# EAGLE design horn (EAGLE 9.3.0)
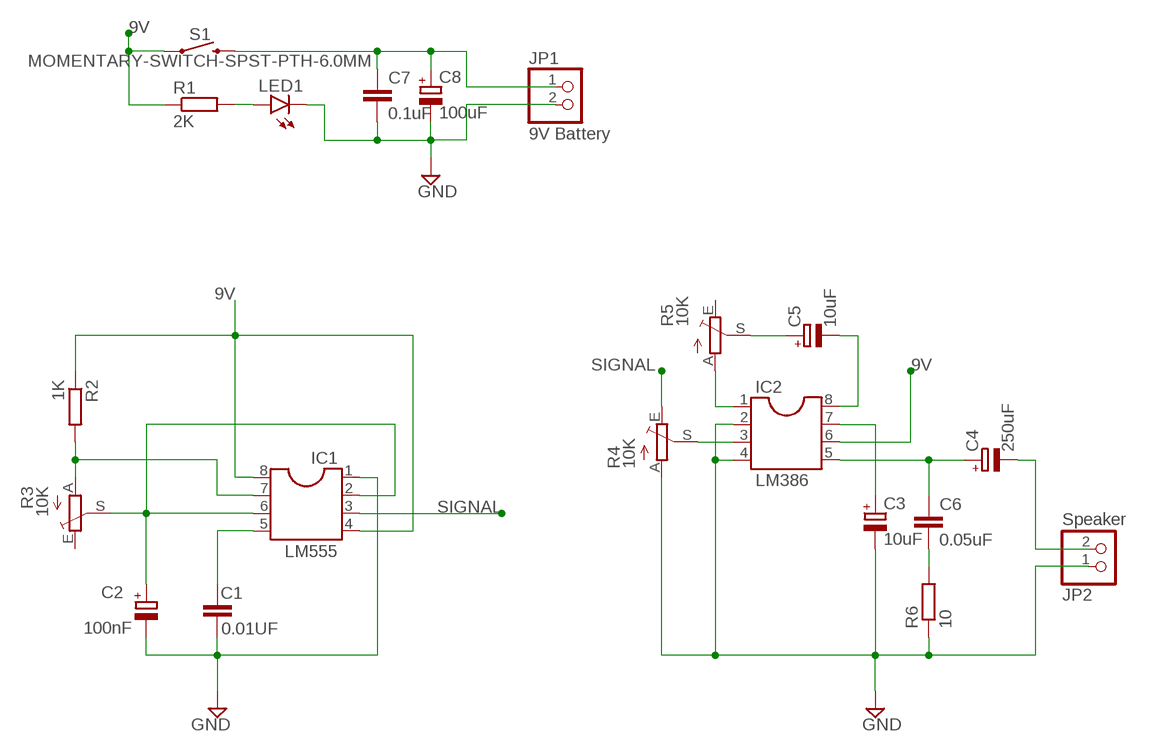
[diagram p0: schematic, sheet 1]

## Parts
C1  0.01UF  C-EU025-024X044  [C025-024X044]
C2  100nF  CPOL-EUE5-5  [E5-5]
C3  10uF  CPOL-EUE5-5  [E5-5]
C4  250uF  CPOL-EUE5-5  [E5-5]
C5  10uF  CPOL-EUE5-5  [E5-5]
C6  0.05uF  C-EU025-024X044  [C025-024X044]
C7  0.1uF  C-EU025-024X044  [C025-024X044]
C8  100uF  CPOL-EUE5-5  [E5-5]
IC1  LM555  DIL8S  [SOCKET-08]
IC2  LM386  DIL8S  [SOCKET-08]
JP1  9V Battery  PINHD-1X2  [1X02]
JP2  Speaker  PINHD-1X2  [1X02]
LED1  LED5MM  [LED5MM]
R1  2K  R-EU_0204/5  [0204/5]
R2  1K  R-EU_0204/5  [0204/5]
R3  10K  TRIM_EU-CA6V  [CA6V]
R4  10K  TRIM_EU-CA6V  [CA6V]
R5  10K  TRIM_EU-CA6V  [CA6V]
R6  10  R-EU_0204/5  [0204/5]
S1  MOMENTARY-SWITCH-SPST-PTH-6.0MM  [TACTILE_SWITCH_PTH_6.0MM]

## Nets
9V: IC1.4 IC1.8 IC2.6 R1.1 R2.1 S1.1
GND: C1.2 C2.- C3.- C7.2 C8.- IC1.1 IC2.2 IC2.4 JP1.2 JP2.1 LED1.K(C) R4.A R6.1
N$1: C7.1 C8.+ JP1.1 S1.3
N$2: C1.1 IC1.5
N$4: IC2.3 R4.S
N$5: LED1.A R1.2
N$6: IC1.7 R2.2 R3.A
N$7: C2.+ IC1.2 IC1.6 R3.S
N$9: C3.+ IC2.7
N$10: C4.+ C6.1 IC2.5
N$11: C6.2 R6.2
N$12: IC2.1 R5.A
N$13: C5.+ R5.S
N$14: C5.- IC2.8
N$15: C4.- JP2.2
SIGNAL: IC1.3 R4.E
Unconnected: R3.E R5.E

## Library data of the parts
C1 C6 C7 = resistor:C-EU: CAPACITOR, European symbol
C2-C5 C8 = resistor:CPOL-EU: POLARIZED CAPACITOR, European symbol
IC1 IC2 = ic-package:DIL8: Dual In Line / Socket
JP1 JP2 = pinhead:PINHD-1X2: PIN HEADER
LED1 = led:LED: LED OSRAM: - CHIPLED LG R971, LG N971, LY N971, LG Q971, LY Q971, LO R971, LY R971 LH N974, LH R974 LS Q976, LO Q976, LY Q976 LO Q996 - Hyper CHIPLED LW Q18S LB Q993, LB Q99A, LB R99A - SideLED LS A670, LO A670, LY A670, LG A670, LP A670 LB A673, LV A673, LT A673, LW A673 LH A674 LY A675 LS A676, LA A676, LO A676, LY A676, LW A676 LS A679, LY A679, LG A679 - Hyper Micro SIDELED® LS Y876, LA Y876, LO Y876, LY Y876 LT Y87S - SmartLED LW L88C, LW L88S LB L89C, LB L89S, LG L890 LS L89K, LO L89K, LY L89K LS L896, LA L896, LO L896, LY L896 - TOPLED LS T670, LO T670, LY T670, LG T670, LP T670 LSG T670, LSP T670, LSY T670, LOP T670, LYG T670 LG T671, LOG T671, LSG T671 LB T673, LV T673, LT T673, LW T673 LH T674 LS T676, LA T676, LO T676, LY T676, LB T676, LH T676, LSB T676, LW T676 LB T67C, LV T67C, LT T67C, LS T67K, LO T67K, LY T67K, LW E67C LS E67B, LA E67B, LO E67B, LY E67B, LB E67C, LV E67C, LT E67C LW T67C LS T679, LY T679, LG T679 LS T770, LO T770, LY T770, LG T770, LP T770 LB T773, LV T773, LT T773, LW T773 LH T774 LS E675, LA E675, LY E675, LS T675 LS T776, LA T776, LO T776, LY T776, LB T776 LHGB T686 LT T68C, LB T68C - Hyper Mini TOPLED® LB M676 - Mini TOPLED Santana® LG M470 LS M47K, LO M47K, LY M47K Source: http://www.osram.convergy.de LUXEON: - LUMILED® LXK2-PW12-R00, LXK2-PW12-S00, LXK2-PW14-U00, LXK2-PW14-V00 LXK2-PM12-R00, LXK2-PM12-S00, LXK2-PM14-U00 LXK2-PE12-Q00, LXK2-PE12-R00, LXK2-PE12-S00, LXK2-PE14-T00, LXK2-PE14-U00 LXK2-PB12-K00, LXK2-PB12-L00, LXK2-PB12-M00, LXK2-PB14-N00, LXK2-PB14-P00, LXK2-PB14-Q00 LXK2-PR12-L00, LXK2-PR12-M00, LXK2-PR14-Q00, LXK2-PR14-R00 LXK2-PD12-Q00, LXK2-PD12-R00, LXK2-PD12-S00 LXK2-PH12-R00, LXK2-PH12-S00 LXK2-PL12-P00, LXK2-PL12-Q00, LXK2-PL12-R00 Source: www.luxeon.com KINGBRIGHT: KA-3528ASYC Source: www.kingbright.com
R1 R2 R6 = rcl:R-EU_: RESISTOR, European symbol; SPICEPREFIX: R
R3-R5 = pot:TRIM_EU-: POTENTIOMETER
S1 = SparkFun-Switches:MOMENTARY-SWITCH-SPST: Momentary Switch (Pushbutton) - SPST Normally-open (NO) SPST momentary switches (buttons, pushbuttons). Variants PTH-12MM - 12mm square, through-hole Momentary Pushbutton Switch - 12mm Square <https://www.sparkfun.com/products/9190> (COM-09190) PTH-6.0MM, PTH-6.0MM-KIT - 6.0mm square, through-hole Mini Pushbutton Switch <https://www.sparkfun.com/products/97> (COM-00097) KIT package intended for soldering kit's - only one side of pads' copper is exposed. PTH-RIGHT-ANGLE-KIT - Right-angle, through-hole Right Angle Tactile Button <https://www.sparkfun.com/products/10791> - Used on SparkFun BigTime Watch Kit <https://www.sparkfun.com/products/11734> SMD-12MM - 12mm square, surface-mount Tactile Button - SMD (12mm) <https://www.sparkfun.com/products/12993> (COM-12993) Used on SparkFun PicoBoard <https://www.sparkfun.com/products/11888> SMD-4.5MM - 4.5mm Square Trackball Switch Used on SparkFun Blackberry Trackballer Breakout <https://www.sparkfun.com/products/13169> SMD-4.6MMX2.8MM - 4.60mm x 2.80mm, surface mount Used on SparkFun SAMD21 Mini Breakout <https://www.sparkfun.com/products/13664> SMD-5.2MM, SMD-5.2-REDUNDANT - 5.2mm square, surface-mount Mini Pushbutton Switch - SMD <https://www.sparkfun.com/products/8720> (COM-08720) Used on Arduino Pro Mini <https://www.sparkfun.com/products/11114> REDUNDANT package connects both switch circuits together SMD-6.0X3.5MM - 6.0 x 3.5mm, surface mount Momentary Reset Switch SMD <https://www.sparkfun.com/products/8229> (COM-08229) SMD-6.2MM-TALL - 6.2mm square, surface mount Tactile Button - SMD (6mm) <https://www.sparkfun.com/products/12992> Used on SparkFun Digital Sandbox <https://www.sparkfun.com/products/12651> SMD-RIGHT-ANGLE - Right-angle, surface mount Used on SparkFun Block for Intel® Edison - Arduino <https://www.sparkfun.com/products/13036>; PROD_ID: SWCH-08441; SF_SKU: COM-00097

## Board
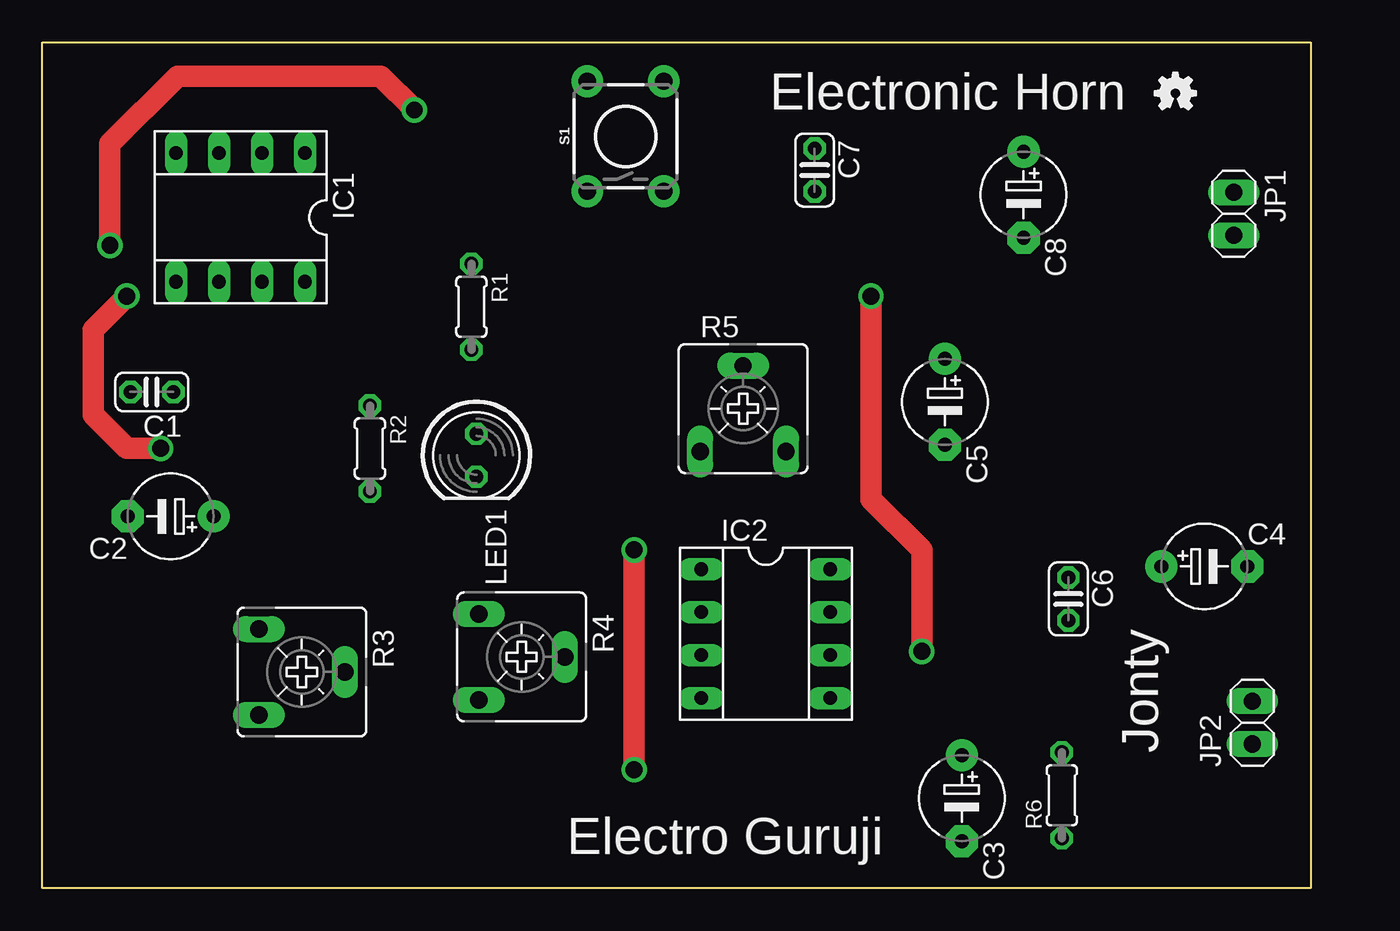
[diagram p1: board, top side]
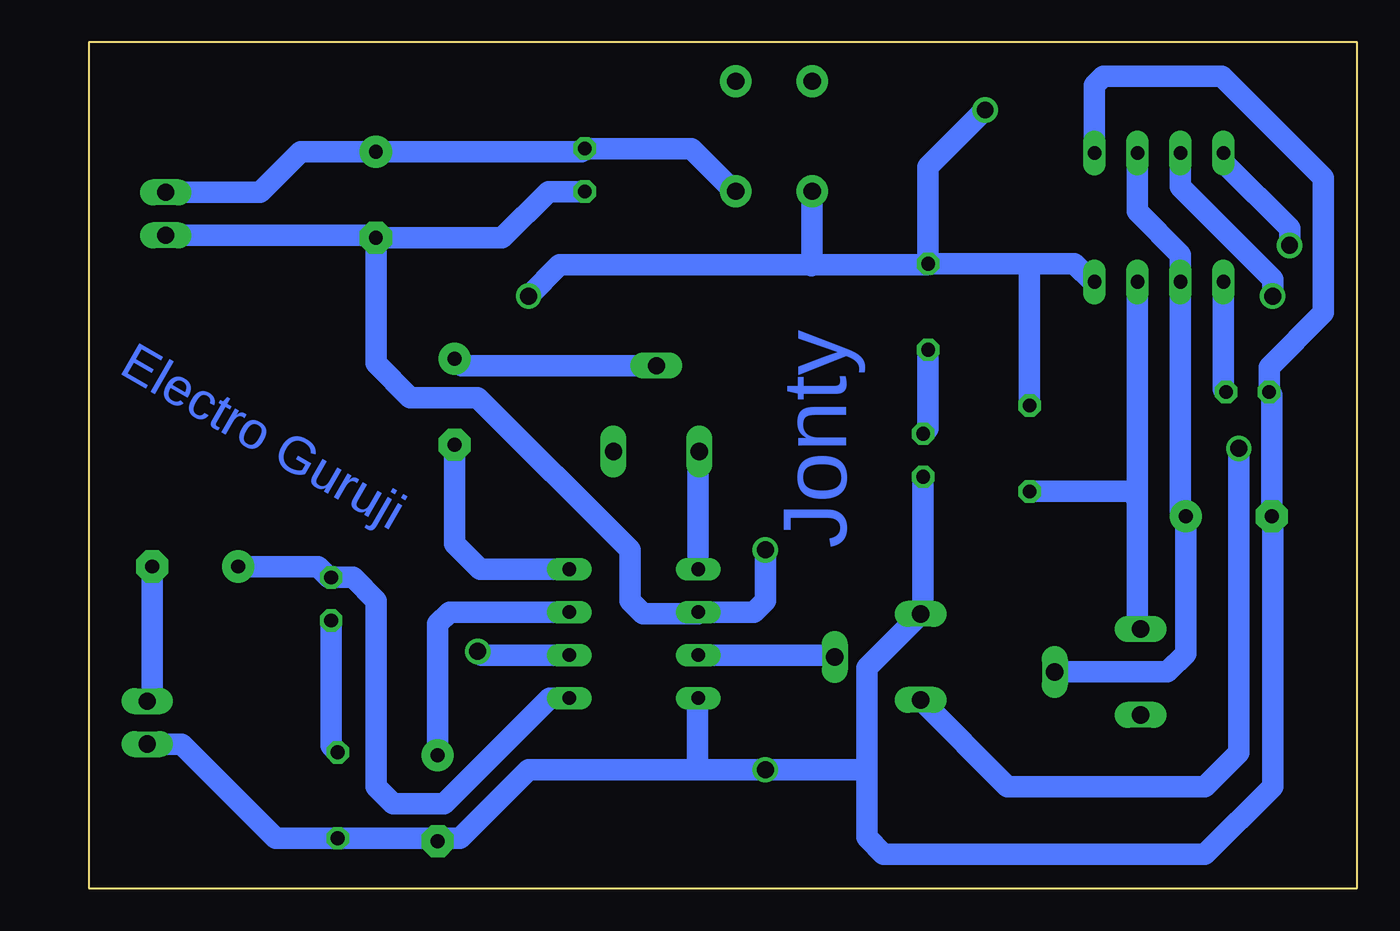
[diagram p2: board, bottom side, seen from below]

Size 75 x 50 mm. Coordinates in mm from the lower left corner, seen from the top.
Outline: 0,50 75,50 75,0 0,0 0,50
Copper layers (1*16): Top 0.035mm / dielectric 1.5mm / Bottom 0.035mm
Design rules "default": minimum track width 6mil, minimum drill 0.35mm, track to track 6mil, track to pad 6mil, pad to pad 6mil, via to via 6mil, smd to smd 6mil, copper to edge 40mil, drill to drill 6mil, minimum pad ring 10mil, minimum via ring 8mil, stop-mask expansion 4mil, vias tented up to drill 0mil, thermal gap 10mil

### Footprints (pad centres in the part's own frame; a part is rotated, then mirrored left to right if it is on the bottom)
C025-024X044 = drill 0.813 octagon: 1 -1.27,0; 2 1.27,0
E5-5 = drill 0.813 pad 1.905: + -2.54,0 | drill 0.813 pad 1.905 octagon: - 2.54,0
SOCKET-08 = drill 0.813 long: 1 -3.81,-3.81; 2 -1.27,-3.81; 3 1.27,-3.81; 4 3.81,-3.81; 5 3.81,3.81; 6 1.27,3.81; 7 -1.27,3.81; 8 -3.81,3.81
1X02 = drill 1.016 long: 1 -1.27,0; 2 1.27,0
LED5MM = drill 0.813 octagon: A -1.27,0; K 1.27,0
0204/5 = drill 0.813 octagon: 1 -2.54,0; 2 2.54,0
CA6V = drill 1.016 long: A -2.54,-2.54; E 2.54,-2.54; S 0,2.54
TACTILE_SWITCH_PTH_6.0MM = drill 1.016 pad 1.88: 1 -3.251,2.261; 2 3.251,2.261; 3 -3.251,-2.261; 4 3.251,-2.261

### Placement (x,y rotation side)
C1  6.48,29.33 180 top
C2  7.59,21.98 180 top
C3  54.37,5.32 270 top
C4  68.71,19.02 0 top
C5  53.37,28.75 270 top
C6  60.67,17.1 270 top
C7  45.67,42.45 270 top
C8  58.02,40.99 270 top
IC1  11.72,39.65 180 top
IC2  42.78,15.05 270 top
JP1  70.45,39.86 270 top
JP2  71.55,9.79 90 top
LED1  25.67,25.59 270 top
R1  25.37,34.37 270 top
R2  19.37,25.99 270 top
R3  15.35,12.78 270 top
R4  28.35,13.67 270 top
R5  41.44,28.35 0 top
R6  60.28,5.49 90 top
S1  34.49,44.44 90 top
U$1  [OSHW-LOGO-MINI]  67,47 0 top

### Tracks (layer width: path | path; a pad name or v marks a point on that pad's centre or on a via)
9V  (via drill 1)
  Top 1.27: v49,35 49,23 52,20 v52,14 | v4,38 4,44 8,48 20,48 v22,46
  Bottom 0.152: 46.45,13.93 IC2.6 | 32.28,41.06 S1.1 | 15.43,35.94 IC1.8 15.59,35.78 | 25.24,36.79 R1.1 25.39,36.79
  Bottom 1.27: IC2.6 51.78,13.78 v52,14 | S1.1 32.23,36.84 | 32.23,36.84 32.28,36.79 | 32.23,36.84 47.16,36.84 v49,35 | 32.23,36.84 25.44,36.84 R1.1 | R1.1 19,36.91 | 19,36.91 16.71,36.91 15.59,35.78 | R2.1 19.37,36.54 19,36.91 | IC1.4 7.91,42.91 4,39 v4,38 | R1.1 25.37,42.63 v22,46
GND  (via drill 1)
  Top 1.27: v35,20 v35,7
  Bottom 0.152: 5.07,29.23 C1.2 | 5.07,22.07 C2.- | 15.43,43.56 IC1.1 | 57.88,38.47 C8.- 58.03,38.47 | 70.38,38.47 JP1.2 | 60.17,2.96 R6.1 | 54.38,2.73 C3.- 54.22,2.73 | 71.44,8.44 JP2.1 | 25.72,16.21 R4.A 25.88,16.06 | 38.83,11.34 IC2.4 38.98,11.34 | 38.98,16.21 IC2.2
  Bottom 1.27: JP2.1 69.52,8.52 63.96,2.96 60.17,2.96 | JP1.2 58.16,38.59 C8.- | C8.- 50.55,38.45 47.82,41.18 C7.2 | C8.- 58.02,31.02 56,29 52,29 43,20 43,17 42.22,16.21 38.98,16.21 | R6.1 54.54,2.95 | 54.54,2.95 C3.- | R4.A 29,13.02 29,7 | 29,7 v35,7 39,7 | 39,7 49,7 53.05,2.95 54.54,2.95 | IC2.4 39,11.21 39,7 | IC2.2 35.68,16.32 35,17 v35,20 | LED1.K 25.67,16.27 25.88,16.06 | C2.- 5,21.94 5,6 9,2 28,2 29,3 29,7 | C2.- 5.05,29.17 C1.2 5.21,30.79 2,34 2,42 8,48 15,48 15.53,47.47 IC1.1
N$1
  Bottom 0.152: 45.54,43.65 C7.1 45.69,43.65 | 36.85,41.21 S1.3 | 70.38,41.21 JP1.1
  Bottom 1.27: JP1.1 64.87,41.13 62.47,43.53 C8.+ 45.86,43.53 C7.1 39.36,43.72 36.85,41.21
N$2
  Bottom 0.152: 7.81,29.38 C1.1 | 7.81,35.78 IC1.5
  Bottom 1.27: IC1.5 7.91,29.49 C1.1
N$4
  Bottom 0.152: 38.83,13.78 IC2.3 | 30.91,13.78 R4.S
  Bottom 1.27: IC2.3 31,13.78 R4.S
N$5
  Bottom 0.152: 25.39,31.76 R1.2
  Bottom 1.27: R1.2 25.37,27.16 LED1.A
N$6
  Bottom 0.152: 13,35.78 IC1.7 | 12.77,15.3 R3.A
  Bottom 1.27: IC1.7 12.99,23 | 12.99,23 12.99,15.5 R3.A | R2.2 13.44,23.45 12.99,23
N$7
  Bottom 0.152: 10.56,35.94 IC1.6 10.4,35.78
  Bottom 0.406: 10,21.85 10.45,22.3
  Bottom 1.27: IC1.2 12.99,41.01 13,41 13,40 10.45,37.45 IC1.6 10.45,22.3 C2.+ 10.13,13.87 11.22,12.78 R3.S
N$9
  Bottom 0.152: 46.6,16.21 IC2.7
  Bottom 1.27: C3.+ 54.37,15.63 53.68,16.32 IC2.7
N$10
  Bottom 0.152: 46.6,11.34 IC2.5 | 60.62,18.35 C6.1 60.78,18.35
  Bottom 1.27: C4.+ 66.15,19 61.43,19 60.78,18.35 | 47.27,11.24 IC2.5 47.76,11.24 54,5 57,5 58,6 58,17 59.37,18.37 C6.1
N$11
  Bottom 0.152: 60.32,8.14 R6.2 | 60.62,15.76 C6.2
  Bottom 1.27: C6.2 60.67,8.42 R6.2
N$12
  Bottom 1.27: R5.A 38.97,25.74 IC2.1
N$13
  Bottom 1.27: R5.S 52.97,30.89 C5.+
N$14
  Bottom 1.27: C5.- 53.37,20.37 51.86,18.86 IC2.8
N$15
  Bottom 0.152: 71.44,11.19 JP2.2
  Bottom 1.27: C4.- 71.25,11.06 JP2.2
SIGNAL  (via drill 1)
  Top 1.27: v5,35 3,33 3,28 5,26 v7,26
  Bottom 0.152: 25.57,10.88 25.72,11.03 R4.E
  Bottom 1.27: R4.E 20.68,6 9,6 7,8 v7,26 | IC1.3 10.45,41.45 5,36 v5,35

### Text on the board
Bottom: Jonty | Electro Guruji | Electro Guruji
tPlace: Electronic Horn | Jonty | Electro Guruji